# Altium project Carte_EV_2018.PrjPcb
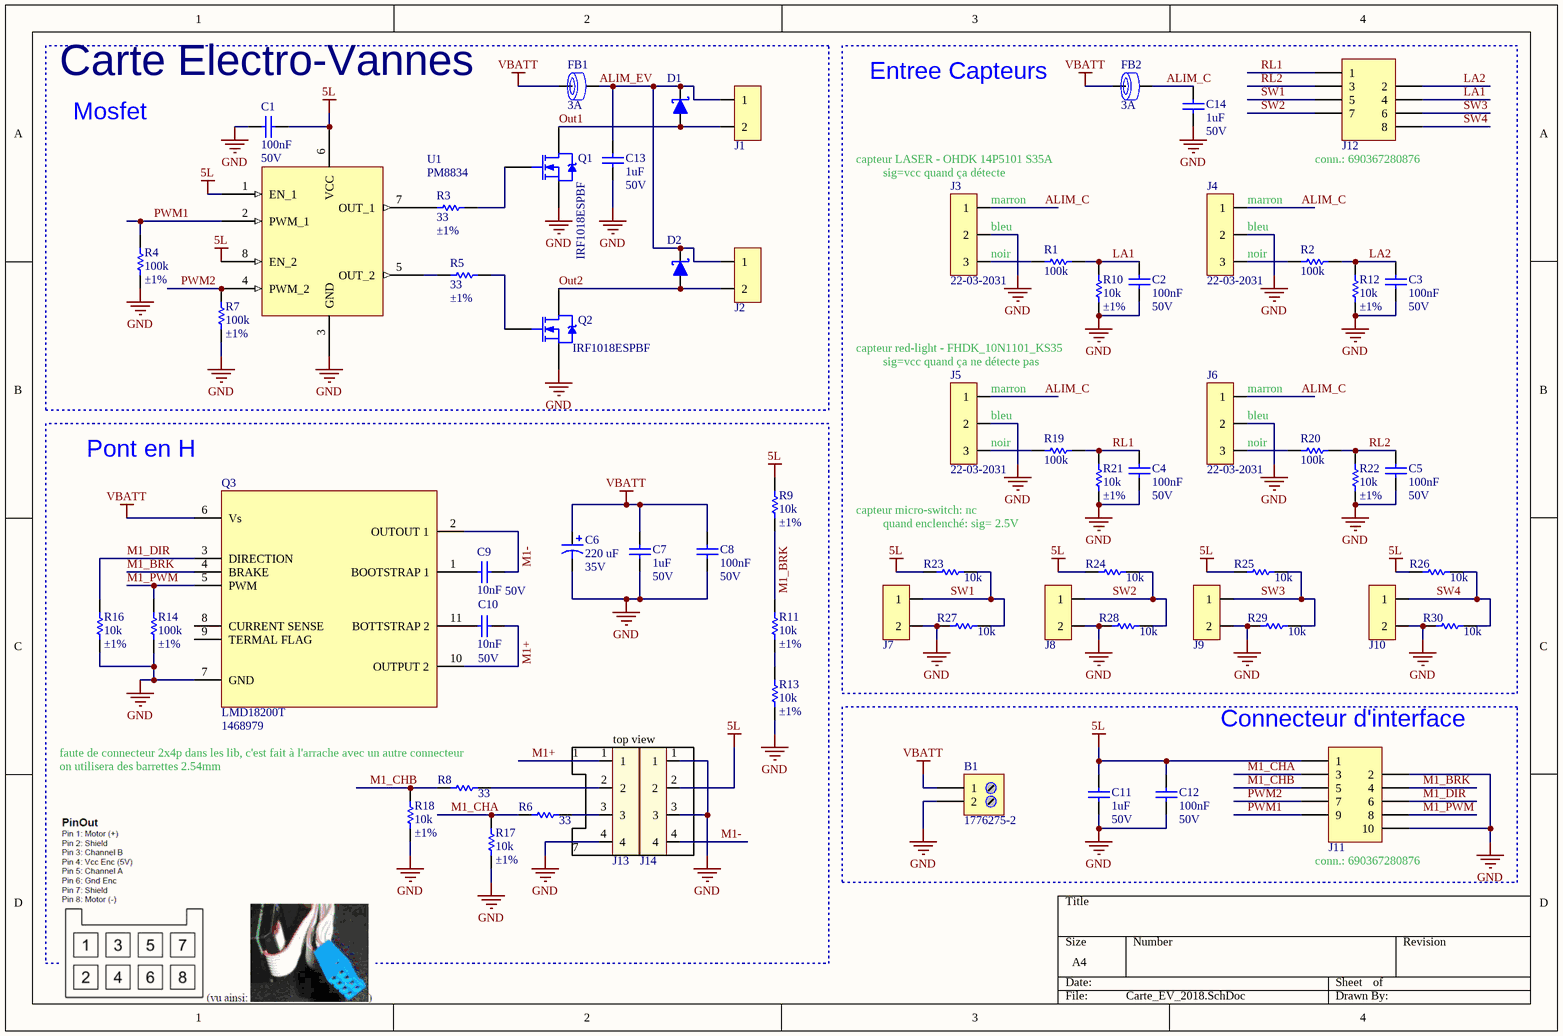
[diagram p0: Carte_EV_2018.SchDoc]
1 sheet, 66 parts. Net scope: global (net labels, ports and power ports of the same name join across sheets).
Board file: Carte_EV_2018.PcbDoc

## Sheet Carte_EV_2018.SchDoc
size A4; Author: Audran; CompanyName: Goldorak; Address1: Electrolab; Address2: 52 rue Paul Lescop; Address3: 92000 Nanterre; ProjectName: Cartes_2017

### Parts
B1  1776275-2  [BORNIER_2V_3.5MM]
C1  100nF  RatedVoltage: 50V  [WCAP-CSGP_0603, 1.6x0.8x0.8]
C2  100nF  RatedVoltage: 50V  [WCAP-CSGP_0603, 1.6x0.8x0.8]
C3  100nF  RatedVoltage: 50V  [WCAP-CSGP_0603, 1.6x0.8x0.8]
C4  100nF  RatedVoltage: 50V  [WCAP-CSGP_0603, 1.6x0.8x0.8]
C5  100nF  RatedVoltage: 50V  [WCAP-CSGP_0603, 1.6x0.8x0.8]
C6  220 uF  RatedVoltage: 35V  [WCAP-ATG8_8x11.5x3.5x0.5]
C7  1uF  RatedVoltage: 50V  [WCAP-CSGP_0805, 2x1.25x1.25]
C8  100nF  RatedVoltage: 50V  [WCAP-CSGP_0603, 1.6x0.8x0.8]
C9  10nF  RatedVoltage: 50V  [WCAP-CSGP_0603, 1.6x0.8x0.8]
C10  10nF  RatedVoltage: 50V  [WCAP-CSGP_0603, 1.6x0.8x0.8]
C11  1uF  RatedVoltage: 50V  [WCAP-CSGP_0805, 2x1.25x1.25]
C12  100nF  RatedVoltage: 50V  [WCAP-CSGP_0603, 1.6x0.8x0.8]
C13  1uF  RatedVoltage: 50V  [WCAP-CSGP_0805, 2x1.25x1.25]
C14  1uF  RatedVoltage: 50V  [WCAP-CSGP_0805, 2x1.25x1.25]
D1  RBR3MM40ATFTR  [SOD-123FL]  (value not drawn)
D2  RBR3MM40ATFTR  [SOD-123FL]  (value not drawn)
FB1  RatedCurrent: 3A  [WE-CBF_0805_High Current]  (hidden comment: 742792023)
FB2  RatedCurrent: 3A  [WE-CBF_0805_High Current]  (hidden comment: 742792023)
J1  22-03-2021  [22-03-2021]  (value not drawn)
J2  22-03-2021  [22-03-2021]  (value not drawn)
J3  22-03-2031  [22-03-2031]
J4  22-03-2031  [22-03-2031]
J5  22-03-2031  [22-03-2031]
J6  22-03-2031  [22-03-2031]
J7  22-03-2021  [22-03-2021]  (value not drawn)
J8  22-03-2021  [22-03-2021]  (value not drawn)
J9  22-03-2021  [22-03-2021]  (value not drawn)
J10  22-03-2021  [22-03-2021]  (value not drawn)
J11  690367281076  [690367281076]  (value not drawn)
J12  690367280876  [690367280876]  (value not drawn)
J13  22-27-2041  [22-27-2041]  (value not drawn)
J14  22-27-2041  [22-27-2041]  (value not drawn)
Q1  IRF1018ESPBF  [D2Pak / AAVID 7109DG]
Q2  IRF1018ESPBF  [D2Pak / AAVID 7109DG]
Q3  LMD18200T  Supplier Part Number 1: 1468979  [LMD18200T]
R1  value 100k  [RESC1608X06N]  (hidden comment: RC0603FR-07100KL)
R2  value 100k  [RESC1608X06N]  (hidden comment: RC0603FR-07100KL)
R3  value 33  Precision: ±1%  [RESC1608X06N]  (hidden comment: RC0603FR-0733RL)
R4  value 100k  Precision: ±1%  [RESC1608X06N]  (hidden comment: RC0603FR-07100KL)
R5  value 33  Precision: ±1%  [RESC1608X06N]  (hidden comment: RC0603FR-0733RL)
R6  value 33  [RESC1608X06N]  (hidden comment: RC0603FR-0733RL)
R7  value 100k  Precision: ±1%  [RESC1608X06N]  (hidden comment: RC0603FR-07100KL)
R8  value 33  [RESC1608X06N]  (hidden comment: RC0603FR-0733RL)
R9  value 10k  Precision: ±1%  [RESC1608X06N]  (hidden comment: RC0603FR-0710KL)
R10  value 10k  Precision: ±1%  [RESC1608X06N]  (hidden comment: RC0603FR-0710KL)
R11  value 10k  Precision: ±1%  [RESC1608X06N]  (hidden comment: RC0603FR-0710KL)
R12  value 10k  Precision: ±1%  [RESC1608X06N]  (hidden comment: RC0603FR-0710KL)
R13  value 10k  Precision: ±1%  [RESC1608X06N]  (hidden comment: RC0603FR-0710KL)
R14  value 100k  Precision: ±1%  [RESC1608X06N]  (hidden comment: RC0603FR-07100KL)
R16  value 10k  Precision: ±1%  [RESC1608X06N]  (hidden comment: RC0603FR-0710KL)
R17  value 10k  Precision: ±1%  [RESC1608X06N]  (hidden comment: RC0603FR-0710KL)
R18  value 10k  Precision: ±1%  [RESC1608X06N]  (hidden comment: RC0603FR-0710KL)
R19  value 100k  [RESC1608X06N]  (hidden comment: RC0603FR-07100KL)
R20  value 100k  [RESC1608X06N]  (hidden comment: RC0603FR-07100KL)
R21  value 10k  Precision: ±1%  [RESC1608X06N]  (hidden comment: RC0603FR-0710KL)
R22  value 10k  Precision: ±1%  [RESC1608X06N]  (hidden comment: RC0603FR-0710KL)
R23  value 10k  [RESC1608X06N]  (hidden comment: RC0603FR-0710KL)
R24  value 10k  [RESC1608X06N]  (hidden comment: RC0603FR-0710KL)
R25  value 10k  [RESC1608X06N]  (hidden comment: RC0603FR-0710KL)
R26  value 10k  [RESC1608X06N]  (hidden comment: RC0603FR-0710KL)
R27  value 10k  [RESC1608X06N]  (hidden comment: RC0603FR-0710KL)
R28  value 10k  [RESC1608X06N]  (hidden comment: RC0603FR-0710KL)
R29  value 10k  [RESC1608X06N]  (hidden comment: RC0603FR-0710KL)
R30  value 10k  [RESC1608X06N]  (hidden comment: RC0603FR-0710KL)
U1  PM8834  [SOIC127P600X175-8N]

### Blocks framed on the sheet
Carte Electro-Vannes: C1 C13 D1 D2 FB1 J1 J2 Q1 Q2 R3-R5 R7 U1
Entree Capteurs: C2-C5 C14 FB2 J3-J10 J12 R1 R2 R10 R12 R19-R30
Pont en H: C6-C10 J13 J14 Q3 R6 R8 R9 R11 R13 R14 R16-R18
Connecteur d'interface: B1 C11 C12 J11

### Nets
5L: C1.2 C11.2 C12.2 J11.1 J14.2 R9.2 R23.2 R24.2 R25.2 R26.2 U1.1(EN_1) U1.6(VCC) U1.8(EN_2)
GND: B1.2 C1.1 C2.1 C3.1 C4.1 C5.1 C6.2 C7.1 C8.1 C11.1 C12.1 C13.1 C14.1 J3.2 J4.2 J5.2 J6.2 J7.2 J8.2 J9.2 J10.2 J11.2 J11.10 J13.4 J14.1 J14.3 Q1.3(S) Q2.3(S) Q3.7(GND) R4.1 R7.1 R10.1 R12.1 R13.1 R14.1 R16.1 R17.1 R18.1 R21.1 R22.1 R27.2 R28.2 R29.2 R30.2 U1.3(GND)
VBATT: B1.1 C6.1 C7.2 C8.2 FB1.1 FB2.1 Q3.6(Vs)
ALIM_C: C14.2 FB2.2 J3.1 J4.1 J5.1 J6.1
ALIM_EV: C13.2 D1.2 D2.2 FB1.2 J1.1 J2.1
LA1: C2.2 J12.4 R1.1 R10.2
LA2: C3.2 J12.2 R2.1 R12.2
M1+: C10.2 J13.1 Q3.10(OUTPUT_2)
M1-: C9.2 J14.4 Q3.2(OUTOUT_1)
M1_BRK: J11.4 Q3.4(BRAKE) R9.1 R11.2
M1_CHA: J11.3 R6.1 R17.2
M1_CHB: J11.5 R8.1 R18.2
M1_DIR: J11.6 Q3.3(DIRECTION) R16.2
M1_PWM: J11.8 Q3.5(PWM) R14.2
Out1: D1.1 J1.2 Q1.2(D)
Out2: D2.1 J2.2 Q2.2(D)
PWM1: J11.9 R4.2 U1.2(PWM_1)
PWM2: J11.7 R7.2 U1.4(PWM_2)
RL1: C4.2 J12.1 R19.1 R21.2
RL2: C5.2 J12.3 R20.1 R22.2
SW1: J7.1 J12.5 R23.1 R27.1
SW2: J8.1 J12.7 R24.1 R28.1
SW3: J9.1 J12.6 R25.1 R29.1
SW4: J10.1 J12.8 R26.1 R30.1
NetC9_1: C9.1 Q3.1(BOOTSTRAP_1)
NetC10_1: C10.1 Q3.11(BOTTSTRAP_2)
NetJ3_3: J3.3 R1.2
NetJ4_3: J4.3 R2.2
NetJ5_3: J5.3 R19.2
NetJ6_3: J6.3 R20.2
NetJ13_2: J13.2 R8.2
NetJ13_3: J13.3 R6.2
NetQ1_1: Q1.1(G) R3.2
NetQ2_1: Q2.1(G) R5.2
NetR3_1: R3.1 U1.7(OUT_1)
NetR5_1: R5.1 U1.5(OUT_2)
NetR11_1: R11.1 R13.2

Not connected (* = marked no-connect by the designer): Q3 8(CURRENT_SENSE) 9(TERMAL_FLAG)

### Notes on the sheet
- Mosfet
- (near J3) capteur LASER - OHDK 14P5101 S35A
- (near J3) sig=vcc quand ça détecte
- (near J12) conn.: 690367280876
- (near J3) marron
- (near J3) bleu
- (near J4) marron
- (near J4) bleu
- (near J3) noir
- (near J4) noir
- capteur red-light - FHDK_10N1101_KS35
- (near J5) sig=vcc quand ça ne détecte pas
- (near J5) marron
- (near J5) bleu
- (near J5) noir
- (near J6) marron
- (near J6) bleu
- (near J6) noir
- capteur micro-switch: nc
- quand enclenché: sig= 2.5V
- faute de connecteur 2x4p dans les lib, c'est fait à l'arrache avec un autre connecteur
- on utilisera des barrettes 2.54mm
- (near J13) 1
- top view
- 7
- (near J11) conn.: 690367280876

### Library data of the parts
B1 = 1776275-2: TERM BLOCK 2POS SIDE ENT 3.5MM; Manufacturer: TE Connectivity AMP Connectors; Supplier 1: Farnell; Supplier Part Number 1: 1098611; Manufacturer Part Number: 1776275-2; ComponentLink1URL: http://www.te.com/commerce/DocumentDelivery/DDEController?Action=srchrtrv&DocNm=1776275&DocType=Customer+Drawing&DocLang=English; ComponentLink1Description: http://www.te.com/commerce/DocumentDelivery/DDEController?Action=srchrtrv&DocNm=1776275&DocType=Customer+Drawing&DocLang=English
C1-C5 C8 C12 = WCAP-CSGP, 885012206095: CAP CER 100nF 50V X7R 0603; Manufacturer: Wurth Elektronik; PublishedDate: Aug 2016; ComponentLink1Description: Manufacturer; ComponentLink1URL: http://www.we-online.de; ComponentLink2Description: Datasheet; ComponentLink2URL: http://katalog.we-online.com/pbs/datasheet/885012206095.pdf; Manufacturer Part Number: 885012206095; Value: 100nF; Size: 0603; CeramicType: X7R
C6 = WCAP-ATG8, 860010574011: CAP Alu 220 UF 20% 35 V; Manufacturer: Wurth Elektronik; PublishedDate: July 2016; ComponentLink1Description: Manufacturer; ComponentLink1URL: http://www.we-online.de; ComponentLink2Description: Datasheet; ComponentLink2URL: http://katalog.we-online.de/pbs/datasheet/860010574011.pdf; Manufacturer Part Number: 860010574011; Value: 220 uF; Size: 8mmx11.5mm
C7 C11 C13 C14 = WCAP-CSGP, 885012207103: CAP CER 1uF 50V X7R 0805; Manufacturer: Wurth Elektronik; PublishedDate: Aug 2016; ComponentLink1Description: Manufacturer; ComponentLink1URL: http://www.we-online.de; ComponentLink2Description: Datasheet; ComponentLink2URL: http://katalog.we-online.com/pbs/datasheet/885012207103.pdf; Manufacturer Part Number: 885012207103; Value: 1uF; Size: 0805; CeramicType: X7R
C9 C10 = WCAP-CSGP, 885012206089: CAP CER 10nF 50V X7R 0603; Manufacturer: Wurth Elektronik; PublishedDate: Aug 2016; ComponentLink1Description: Manufacturer; ComponentLink1URL: http://www.we-online.de; ComponentLink2Description: Datasheet; ComponentLink2URL: http://katalog.we-online.com/pbs/datasheet/885012206089.pdf; Manufacturer Part Number: 885012206089; Value: 10nF; Size: 0603; CeramicType: X7R
D1 D2 = RBR3MM40ATFTR: DIODE SCHOTTKY 40V 3A SOD123-FL; Manufacturer: ROHM; Type: Schottky; ReverseVoltage: 40V; ContinuousForwardCurrent: 3A; ComponentLink1Description: Manufacturer; ComponentLink1URL: http://www.rohm.com/web/global/products/-/product/RBR3MM40ATF; ComponentLink2URL: http://www.farnell.com/datasheets/2067190.pdf; ComponentLink2Description: Datasheet; Supplier 1: Farnell; Supplier Part Number 1: 2581593; Manufacturer Part Number: RBR3MM40ATFTR
FB1 FB2 = WE-CBF, 742792023: Ferrite Bead 120ohm 0805 max3.0A; Manufacturer: Wurth Elektronik; Value: 120Ω; Type: High Current; PublishedDate: Aug 2016; ComponentLink1Description: Manufacturer; ComponentLink1URL: http://www.we-online.de; ComponentLink2Description: Datasheet; ComponentLink2URL: http://katalog.we-online.de/pbs/datasheet/742792023.pdf; Manufacturer Part Number: 742792023; Size: 0805
J1 J2 J7-J10 = 22-03-2021: Manufacturer 1: MOLEX; Supplier 1: Farnell; Supplier Part Number 1: 9731075; Manufacturer Part Number: 22-03-2021; Pricing: 10=0.189, 100=0.147, 200=0.119, 500=0.108, 1000=0.088, 2500=0.08, 2500=0.0711, 20000=0.064 (EUR); ComponentLink1URL: http://www.farnell.com/cad/1533907.pdf; ComponentLink1Description: http://www.farnell.com/cad/1533907.pdf; ComponentLink2URL: http://www.farnell.com/datasheets/1791308.pdf; ComponentLink2Description: http://www.farnell.com/datasheets/1791308.pdf
J3-J6 = 22-03-2031: Manufacturer 1: MOLEX; Supplier 1: Farnell; Supplier Part Number 1: 9731083; Manufacturer Part Number: 22-03-2031; Pricing: 10=0.27, 100=0.242, 200=0.22, 500=0.208, 1000=0.202, 2500=0.196 (EUR); ComponentLink1URL: http://www.farnell.com/cad/1533907.pdf; ComponentLink1Description: http://www.farnell.com/cad/1533907.pdf; ComponentLink2URL: http://www.farnell.com/datasheets/1785732.pdf; ComponentLink2Description: http://www.farnell.com/datasheets/1785732.pdf
J11 = 690367281076: WR-MM 10p Female SMT Connector with Polarization; Manufacturer: Wurth Electronics Inc.; Value: 10; Manufacturer Part Number: 690367281076; ComponentLink1URL: http://www.we-online.com; ComponentLink2URL: http://katalog.we-online.de/em/datasheet/69036728xx76.pdf; Supplier 1: Farnell; Supplier Part Number 1: 1641851; ComponentLink1Description: Manufacturer; ComponentLink2Description: Datasheet
J12 = 690367280876: WR-MM 8p Female SMT Connector with Polarization; Manufacturer: Wurth Electronics Inc.; Value: 8; Manufacturer Part Number: 690367280876; ComponentLink1URL: http://www.we-online.com; ComponentLink2URL: http://katalog.we-online.de/em/datasheet/69036728xx76.pdf; Supplier 1: Farnell; Supplier Part Number 1: 1641850; ComponentLink1Description: Manufacturer; ComponentLink2Description: Datasheet
J13 J14 = 22-27-2041: Manufacturer 1: MOLEX; Manufacturer Part Number: 22-27-2041..; Supplier 1: Farnell; Supplier Part Number 1: 9731164; Pricing: 10=0.28, 100=0.24, 200=0.22, 500=0.199, 1000=0.175, 2500=0.128, 2500=0.0898, 30000=0.0812 (EUR); ComponentLink1URL: http://www.farnell.com/cad/1595526.pdf; ComponentLink1Description: http://www.farnell.com/cad/1595526.pdf; ComponentLink2URL: http://www.farnell.com/datasheets/1803079.pdf; ComponentLink2Description: http://www.farnell.com/datasheets/1803079.pdf
Q1 Q2 = IRF1018ESPBF: MOSFET N-CH 60V 79A D2PAK; Manufacturer: Infineon Technologies; Supplier 1: Farnell; Supplier Part Number 1: 1602225; Manufacturer Part Number: IRF1018ESPBF; ComponentLink1URL: http://www.irf.com/product-info/datasheets/data/irf1018epbf.pdf; ComponentLink1Description: Datasheet
Q3 = LMD18200T: Manufacturer Part Number: LMD18200T/NOPB; Manufacturer: TEXAS INSTRUMENTS; Supplier 1: Farnell
R1 R2 R4 R7 R14 R19 R20 = RC0603FR-07100KL: RES SMD 100K OHM 1% 1/10W 0603; Manufacturer: Yageo; Power: 100mW; Vmax: 50V; Manufacturer Part Number: RC0603FR-07100KL; Type: Thick Film; ComponentLink1Description: Manufacturer; ComponentLink1URL: http://www.yageo.com/NewPortal/_en/index.jsp; ComponentLink2Description: Datasheet; ComponentLink2URL: http://www.farnell.com/datasheets/2167052.pdf; Supplier 1: Farnell; Supplier Part Number 1: 2309107
  R1 R2 R19 R20: Precision: ±1%
R3 R5 R6 R8 = RC0603FR-0733RL: RES SMD 33 OHM 1% 1/10W 0603; Manufacturer: Yageo; Power: 100mW; Vmax: 50V; Manufacturer Part Number: RC0603FR-0733RL; Type: Thick Film; ComponentLink1Description: Manufacturer; ComponentLink1URL: http://www.yageo.com/NewPortal/_en/index.jsp; ComponentLink2Description: Datasheet; ComponentLink2URL: http://www.farnell.com/datasheets/2167052.pdf; Supplier 1: Farnell; Supplier Part Number 1: 9238301
  R6 R8: Precision: ±1%
R9-R13 R16-R18 R21-R30 = RC0603FR-0710KL: RES SMD 10K OHM 1% 1/10W 0603; Manufacturer: Yageo; Power: 100mW; Vmax: 50V; Manufacturer Part Number: RC0603FR-0710KL; Type: Thick Film; ComponentLink1Description: Manufacturer; ComponentLink1URL: http://www.yageo.com/NewPortal/_en/index.jsp; ComponentLink2Description: Datasheet; ComponentLink2URL: http://www.farnell.com/datasheets/2167052.pdf; Supplier 1: Farnell; Supplier Part Number 1: 9238603
  R23-R30: Precision: ±1%
U1 = PM8834: IC MOSFET DVR 4A DUAL 8SOIC; Manufacturer: STMicroelectronics; ComponentLink1URL: http://www.st.com/content/ccc/resource/technical/document/datasheet/9a/22/3e/55/d3/f8/46/d5/CD00212712.pdf/files/CD00212712.pdf/jcr:content/translations/en.CD00212712.pdf; ComponentLink1Description: Datasheet; Manufacturer Part Number: PM8834; Supplier 1: Digi-Key; Supplier Part Number 1: PM8834-ND